# Altium schematic sheet PMIC_1V8.SchDoc: 1.8V Power Supply
size B; CheckedBy: Jason Sullins; Author: Jordan Harris-Toovy; Revision: 0.2; SheetNumber: 11; SheetTotal: 22; Size: ANSI B
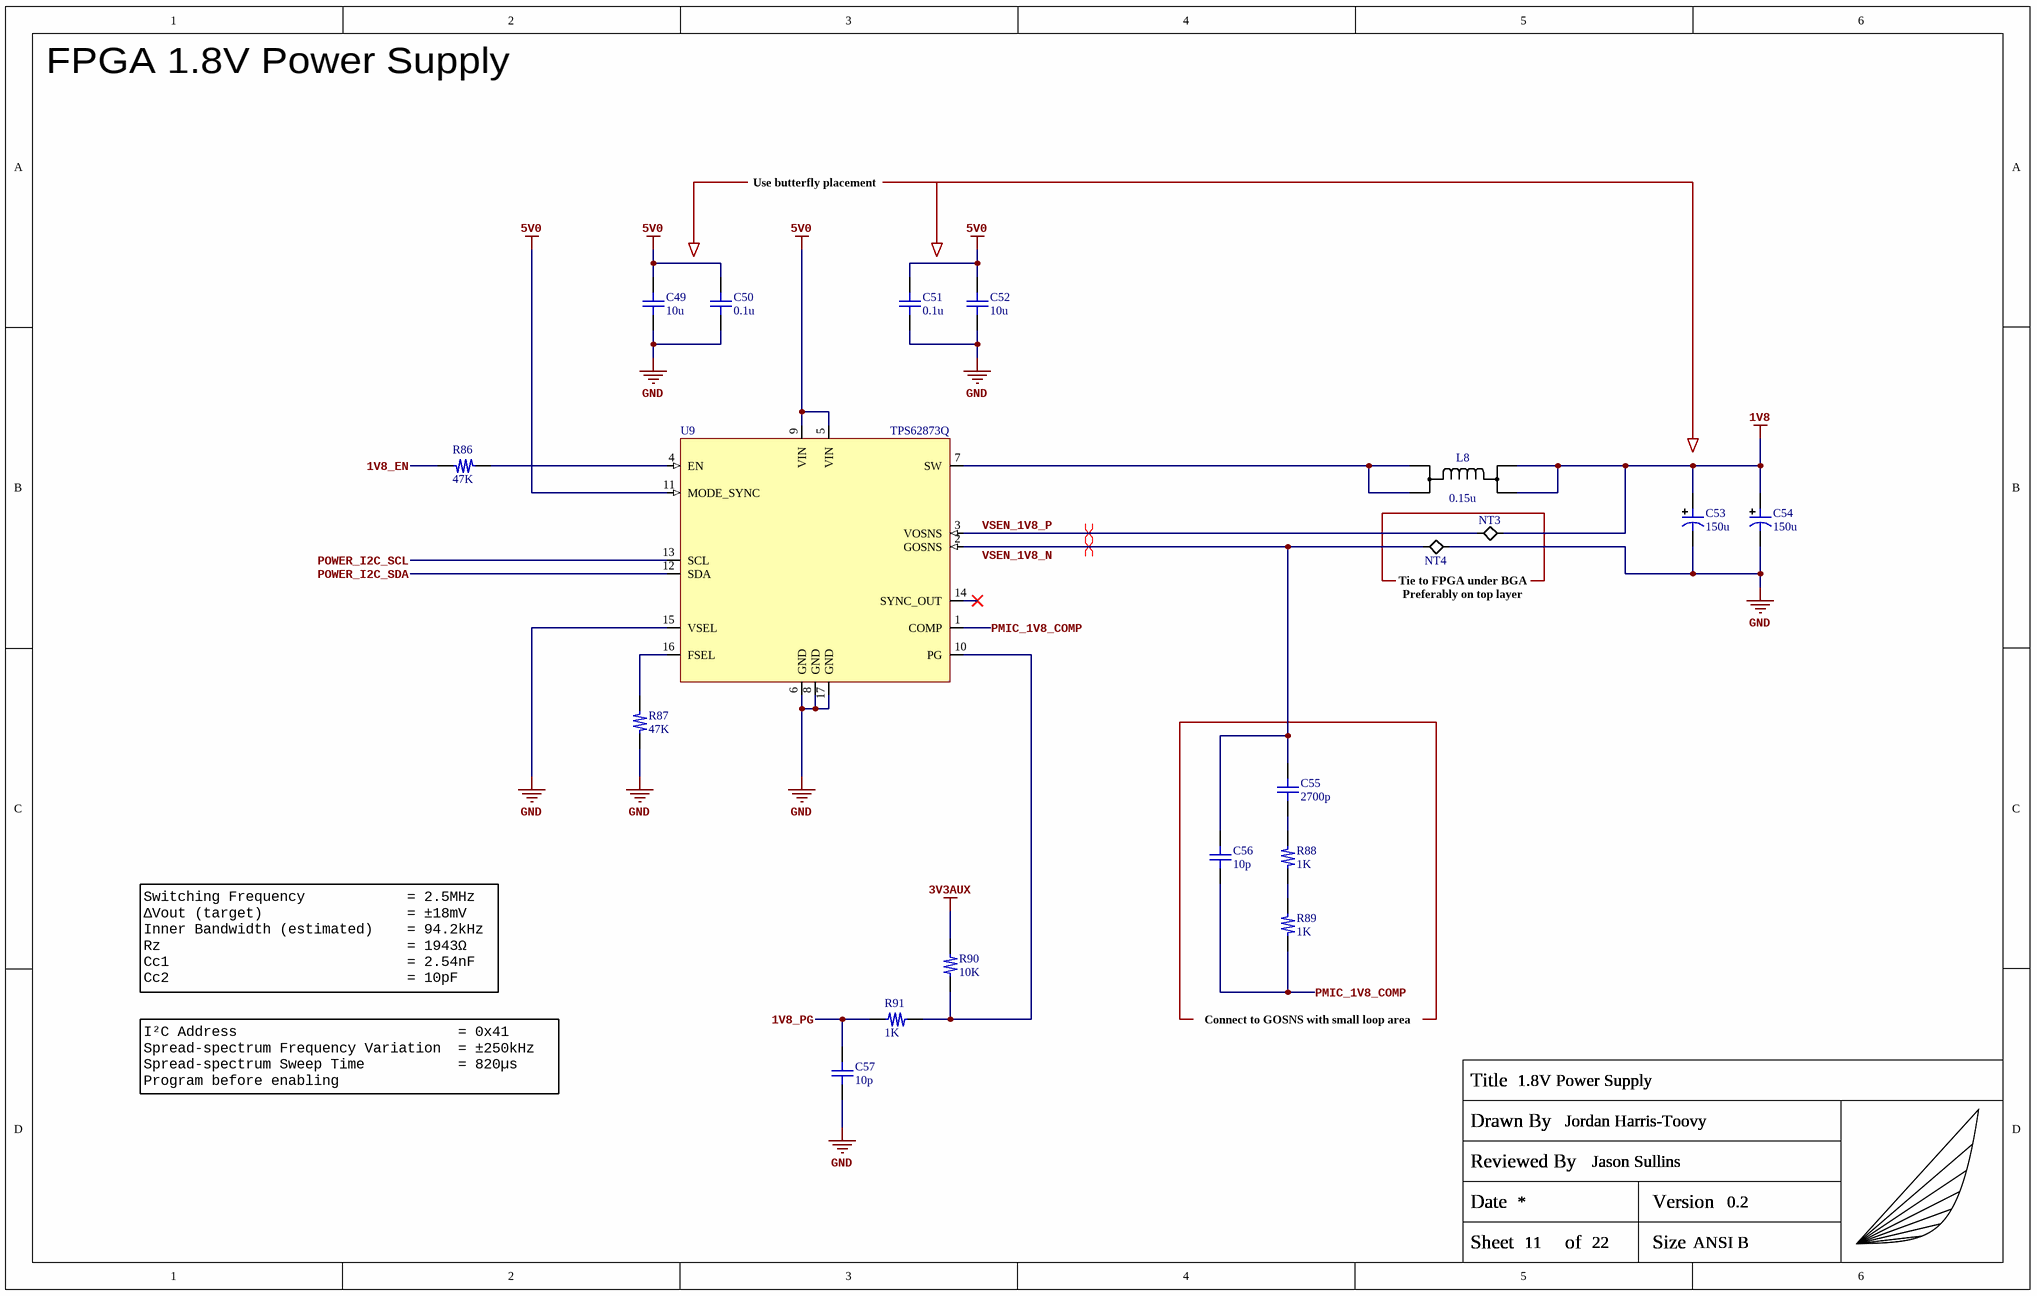
[diagram p0: PMIC_1V8.SchDoc]

## Parts
C49  10u  [C_0402_Generic]
C50  0.1u  [C_0402_Generic]
C51  0.1u  [C_0402_Generic]
C52  10u  [C_0402_Generic]
C53  150u  [C_TANT_EIA-3528-21_B]
C54  150u  [C_TANT_EIA-3528-21_B]
C55  2700p  [C_0402_Generic]
C56  10p  [C_0402_Generic]
C57  10p  [C_0402_Generic]
L8  0.15u  [TDK_CLT32]
NT3  NT  [SMD_NET_TIE]  (value not drawn)  (net tie, no BOM)
NT4  NT  [SMD_NET_TIE]  (value not drawn)  (net tie, no BOM)
R86  47K  [R_0402_Generic]
R87  47K  [R_0402_Generic]
R88  1K  [R_0402_Generic]
R89  1K  [R_0402_Generic]
R90  10K  [R_0402_Generic]
R91  1K  [R_0402_Generic]
TITLEBLOCK?  Capstone_Title_Block  (value not drawn)  (graphical)
U9  TPS62873Q  [TPS6287x-Q1]

## Nets
1V8: C53.1 C54.1 L8.3(P3) L8.4(P4) NT3.2(P2)
3V3AUX: R90.2
5V0: C49.2 C50.2 C51.2 C52.2 U9.5(VIN) U9.9(VIN) U9.11(MODE_SYNC)
GND: C49.1 C50.1 C51.1 C52.1 C53.2 C54.2 C57.1 NT4.2(P2) R87.1 U9.6(GND) U9.8(GND) U9.15(VSEL) U9.17(GND)
1V8_EN: R86.2
1V8_PG: C57.2 R91.1
PMIC_1V8_COMP: C56.1 R89.1 U9.1(COMP)
POWER_I2C_SCL: U9.13(SCL)
POWER_I2C_SDA: U9.12(SDA)
VSEN_1V8_N: C55.2 C56.2 NT4.1(P1) U9.2(GOSNS)
VSEN_1V8_P: NT3.1(P1) U9.3(VOSNS)
NetC55_1: C55.1 R88.2
NetL8_1: L8.1(P1) L8.2(P2) U9.7(SW)
NetR86_1: R86.1 U9.4(EN)
NetR87_2: R87.2 U9.16(FSEL)
NetR88_1: R88.1 R89.2
NetR90_1: R90.1 R91.2 U9.10(PG)

Not connected (* = marked no-connect by the designer): U9 14(SYNC_OUT)*

## Layout directives
differential pair; differential pair class DP_PMIC_SENSE: VSEN_1V8_N, VSEN_1V8_P

## Notes on the sheet
- FPGA 1.8V Power Supply
- Use butterfly placement
- Tie to FPGA under BGA
- Preferably on top layer
- Switching Frequency            = 2.5MHz
  ΔVout (target)                 = ±18mV
  Inner Bandwidth (estimated)    = 94.2kHz
  Rz                             = 1943Ω
  Cc1                            = 2.54nF
  Cc2                            = 10pF
- Connect to GOSNS with small loop area
- I²C Address                          = 0x41
  Spread-spectrum Frequency Variation  = ±250kHz
  Spread-spectrum Sweep Time           = 820µs
  Program before enabling
- (in symbol Capstone_Title_Block) Title; Drawn By; Reviewed By; Date; Version; Sheet; of; Size

## Library data of the parts
C49 C52 = CC0402MRX5R6BB106: 10µF 10V X5R SMD ceramic capacitor in 0402 size; Manufacturer: YAGEO; Manufacturer Part Number: CC0402MRX5R6BB106
C50 C51 = GRM155R71C104KA88D: 0.1µF 16V X7R SMD ceramic capacitor in 0402 size; Manufacturer: Murata Electronics; Manufacturer Part Number: GRM155R71C104KA88D
C53 C54 = T55B157M6R3C0025: 150µF 6.3V 25mOhm SMD tantalum capacitor in EIA-3528-21size; Manufacturer: Vishay Polytech; Manufacturer Part Number: T55B157M6R3C0025
C55 = GCM155R71H272KA37D: 2700pF 50V X7R SMD ceramic capacitor in 0402 size; Manufacturer: Murata Electronics; Manufacturer Part Number: GCM155R71H272KA37D
C56 C57 = GRM1555C1H100JA01D: 10pF 50V C0G/NP0 SMD ceramic capacitor in 0402 size; Manufacturer: Murata Electronics; Manufacturer Part Number: GRM1555C1H100JA01D
L8 = CLT3217N: Inductor 150nH 3.3mOhm 25.4A AEC-Q200, TDK; Manufacturer: EPCOS/TDK; Manufacturer Part Number: CLT32-17N
NT3 NT4 = Net_Tie_SMD: SMD Net Tie; Manufacturer: NONE; Manufacturer Part Number: NONE
R86 R87 = ERJ-2RKF4702X: 47KOhm 1% 1/10W SMD resistor in 0402 size; Manufacturer: Panasonic; Manufacturer Part Number: ERJ-2RKF4702X
R88 R89 R91 = ERJ-2RKF1001X: 1KOhm 1% 1/10W SMD resistor in 0402 size; Manufacturer: Panasonic; Manufacturer Part Number: ERJ-2RKF1001X
R90 = ERJ-2RKF1002X: 10KOhm 1% 1/10W SMD resistor in 0402 size; Manufacturer: Panasonic; Manufacturer Part Number: ERJ-2RKF1002X
TITLEBLOCK? = Capstone_Title_Block: Custom title block with personal logo; Manufacturer: NONE; Manufacturer Part Number: NONE
U9 = TPS62873QWRXSRQ1: Switching Voltage Regulators Automotive 2.7-V to 6-V input, 15-A, stackable, synchronous buck converter 16-VQFN-FCRLF -40 to 125C; Manufacturer: Texas Instruments; Manufacturer Part Number: TPS62873QWRXSRQ1